# EAGLE design SSM_RGB (EAGLE 8.4.3)
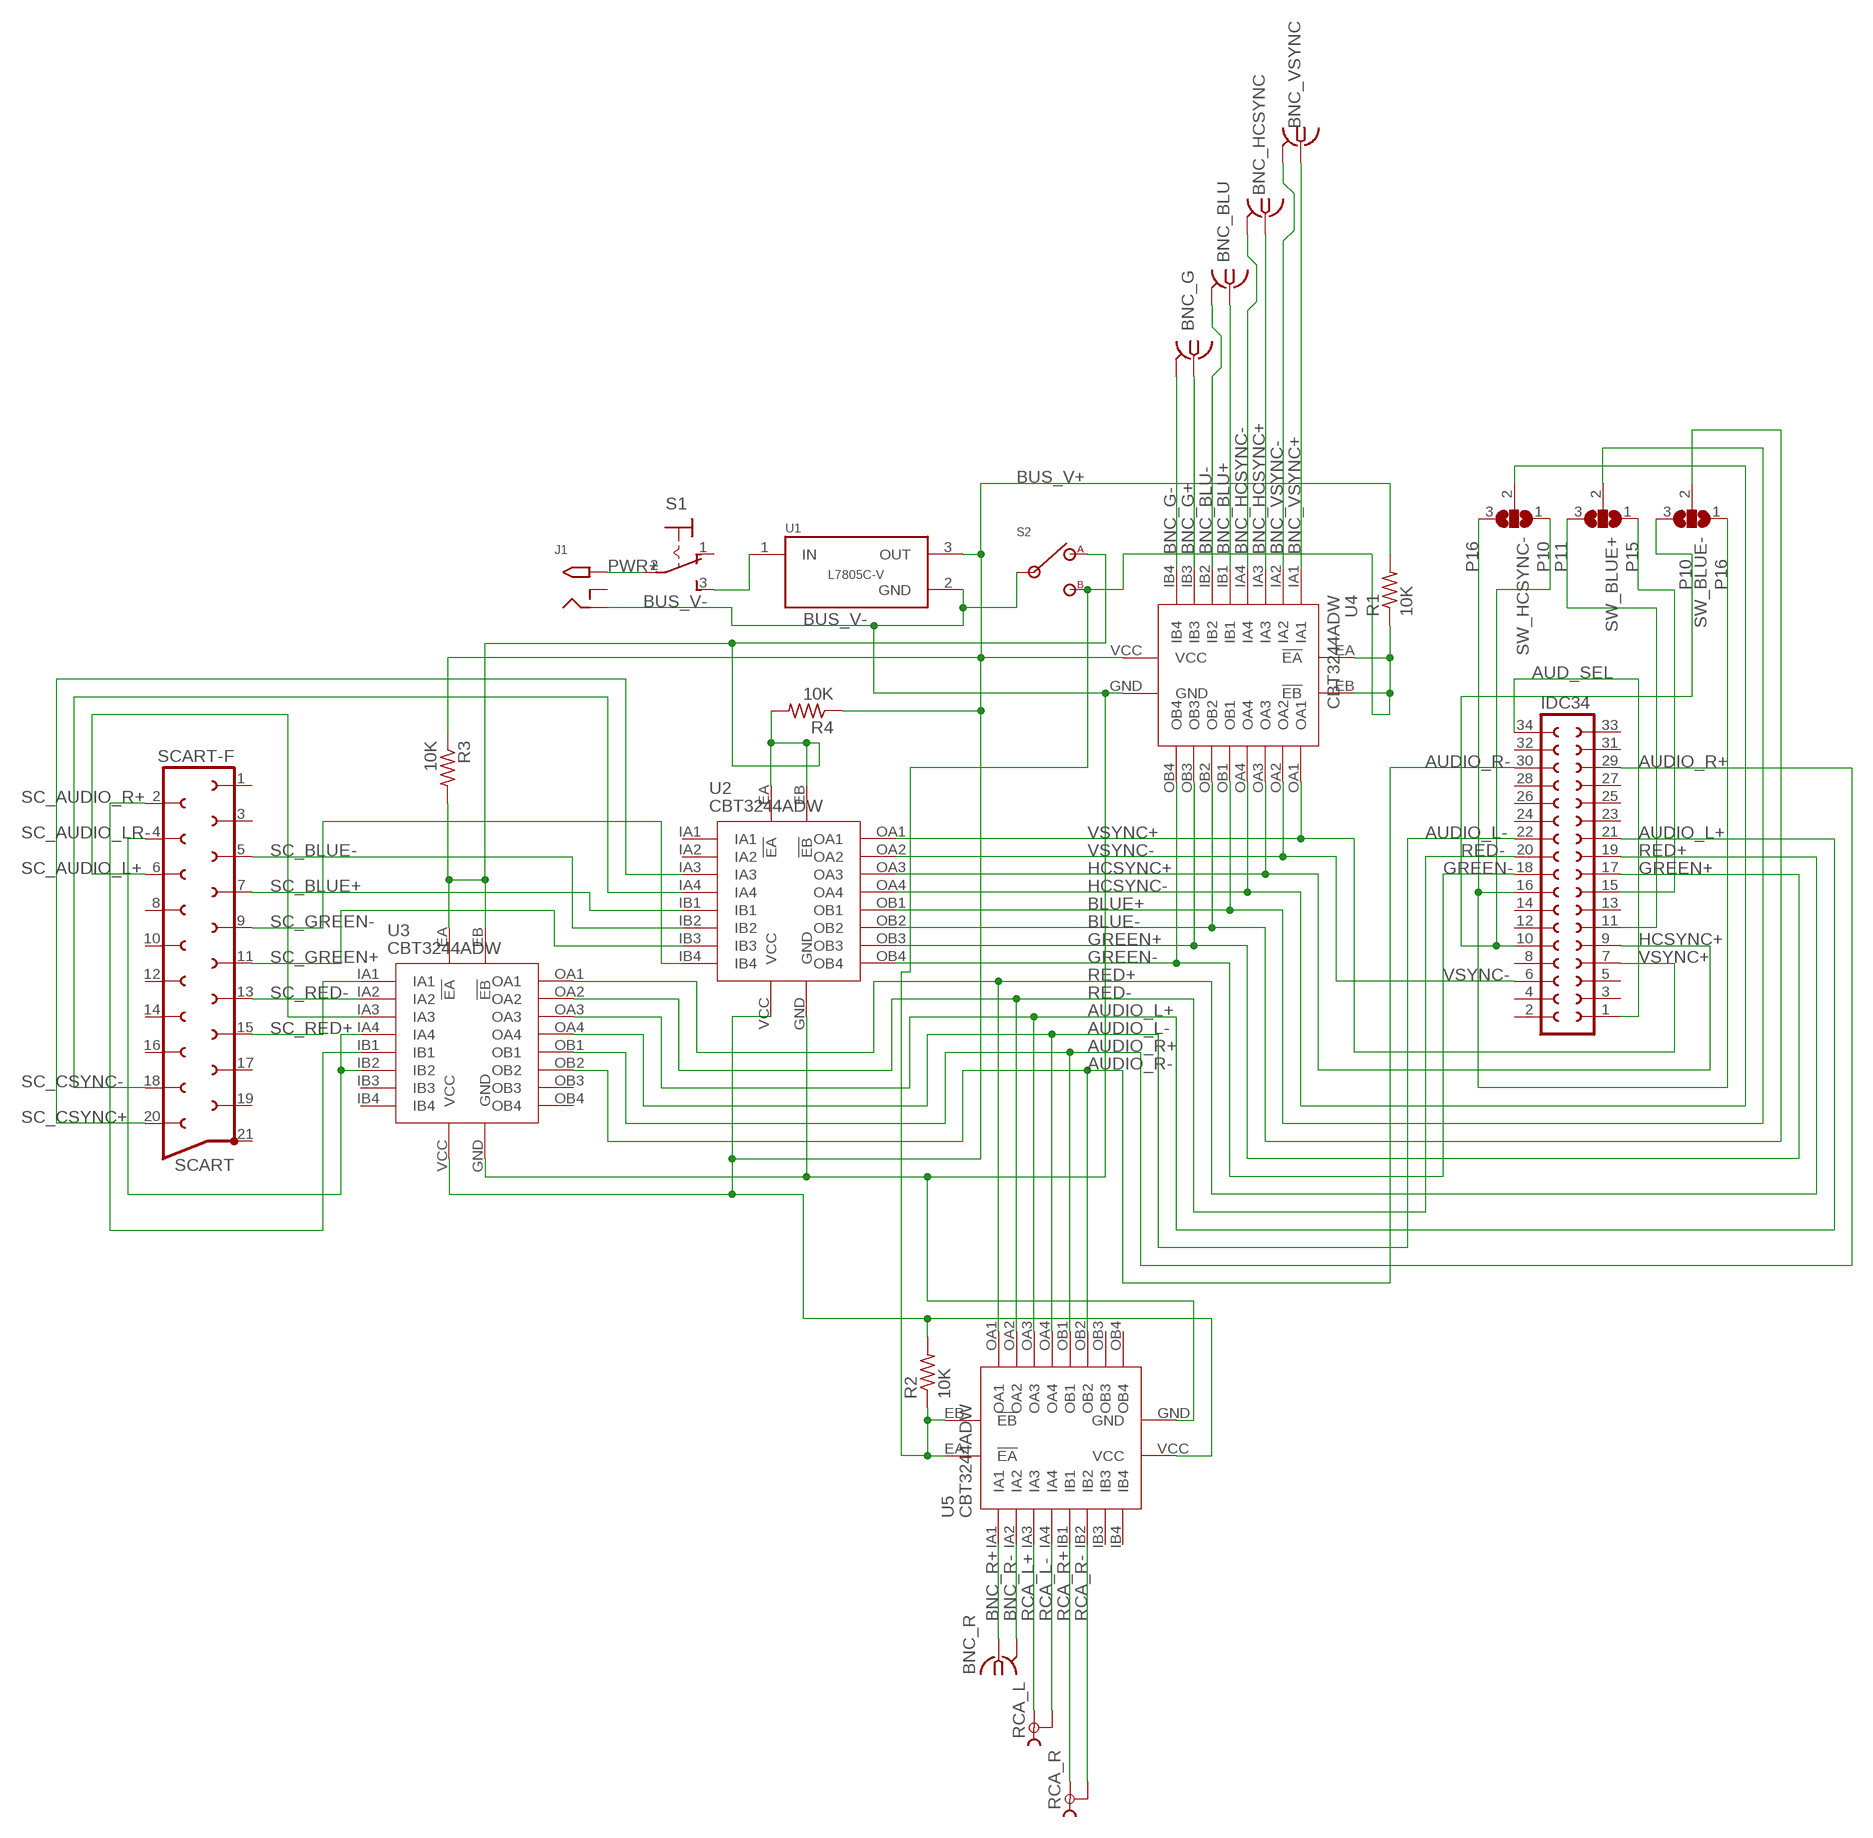
[diagram p0: schematic, sheet 1]

## Parts
BNC_BLU  142142  [142142]
BNC_G  142142  [142142]
BNC_HCSYNC  142142  [142142]
BNC_R  142142  [142142]
BNC_VSYNC  142142  [142142]
IDC34  SOCKET-34RA  [S34RA]
J1  2.1MMJACKTHM  [PJ-102A]
R1  10K  R-US_0207/10  [0207/10]
R2  10K  R-US_0207/10  [0207/10]
R3  10K  R-US_0207/10  [0207/10]
R4  10K  R-US_0207/10  [0207/10]
RCA_L  TOBU3  [TOBU3]
RCA_R  TOBU3  [TOBU3]
S1  320-916  [320-916]
S2  STS121PC04  [STS121PC04]
SCART  SCART-F  [SCART-F]
SW_BLUE+  SJ2W  [SJ_2]
SW_BLUE-  SJ2W  [SJ_2]
SW_HCSYNC-  SJ2W  [SJ_2]
U1  L7805C-V  [TO254P460X1020X1945-3P]
U2  CBT3244ADW  [SOIC-20]
U3  CBT3244ADW  [SOIC-20]
U4  CBT3244ADW  [SOIC-20]
U5  CBT3244ADW  [SOIC-20]

## Nets
AUD_SEL: IDC34.1 IDC34.34
AUDIO_L+: IDC34.21 U3.OA3 U5.OA3
AUDIO_L-: IDC34.22 U3.OA4 U5.OA4
AUDIO_R+: IDC34.29 U3.OB1 U5.OB1
AUDIO_R-: IDC34.30 U3.OB2 U5.OB2
BLUE+: SW_BLUE+.2 U2.OB1 U4.OB1
BLUE-: SW_BLUE-.2 U2.OB2 U4.OB2
BNC_BLU+: BNC_BLU.1 U4.IB1
BNC_BLU-: BNC_BLU.2 BNC_BLU.3 BNC_BLU.4 BNC_BLU.5 U4.IB2
BNC_G+: BNC_G.1 U4.IB3
BNC_G-: BNC_G.2 BNC_G.3 BNC_G.4 BNC_G.5 U4.IB4
BNC_HCSYNC+: BNC_HCSYNC.1 U4.IA3
BNC_HCSYNC-: BNC_HCSYNC.2 BNC_HCSYNC.3 BNC_HCSYNC.4 BNC_HCSYNC.5 U4.IA4
BNC_R+: BNC_R.1 U5.IA1
BNC_R-: BNC_R.2 BNC_R.3 BNC_R.4 BNC_R.5 U5.IA2
BNC_VSYNC+: BNC_VSYNC.1 U4.IA1
BNC_VSYNC-: BNC_VSYNC.2 BNC_VSYNC.3 BNC_VSYNC.4 BNC_VSYNC.5 U4.IA2
BUS_V+: R1.2 R2.2 R3.1 R4.1 U1.3(OUT) U2.VCC U3.VCC U4.VCC U5.VCC
BUS_V-: J1.RING S2.2 U1.2(GND) U2.GND U3.GND U4.GND U5.GND
GREEN+: IDC34.17 U2.OB3 U4.OB3
GREEN-: IDC34.18 U2.OB4 U4.OB4
HCSYNC+: IDC34.9 U2.OA3 U4.OA3
HCSYNC-: SW_HCSYNC-.2 U2.OA4 U4.OA4
N$1: R1.1 R2.1 S2.3 U4.EA(!EA) U4.EB(!EB) U5.EA(!EA) U5.EB(!EB)
N$2: S1.3(S) U1.1(IN)
N$4: R3.2 R4.2 S2.1 U2.EA(!EA) U2.EB(!EB) U3.EA(!EA) U3.EB(!EB)
P10: IDC34.10 SW_BLUE-.3 SW_HCSYNC-.1
P11: IDC34.11 SW_BLUE+.3
P15: IDC34.15 SW_BLUE+.1
P16: IDC34.16 SW_BLUE-.1 SW_HCSYNC-.3
PWR+: J1.TIP S1.2(P)
RCA_L+: RCA_L.1 U5.IA3
RCA_L-: RCA_L.2 RCA_L.2@1 RCA_L.2@2 U5.IA4
RCA_R+: RCA_R.1 U5.IB1
RCA_R-: RCA_R.2 RCA_R.2@1 RCA_R.2@2 U5.IB2
RED+: IDC34.19 U3.OA1 U5.OA1
RED-: IDC34.20 U3.OA2 U5.OA2
SC_AUDIO_L+: SCART.6 U3.IA3
SC_AUDIO_LR-: SCART.4 U3.IA4 U3.IB2
SC_AUDIO_R+: SCART.2 U3.IB1
SC_BLUE+: SCART.7 U2.IB1
SC_BLUE-: SCART.5 U2.IB2
SC_CSYNC+: SCART.20 U2.IA3
SC_CSYNC-: SCART.18 U2.IA4
SC_GREEN+: SCART.11 U2.IB3
SC_GREEN-: SCART.9 U2.IB4
SC_RED+: SCART.15 U3.IA1
SC_RED-: SCART.13 U3.IA2
VSYNC+: IDC34.7 U2.OA1 U4.OA1
VSYNC-: IDC34.6 U2.OA2 U4.OA2
Unconnected: IDC34.2 IDC34.3 IDC34.4 IDC34.5 IDC34.8 IDC34.12 IDC34.13 IDC34.14 IDC34.23 IDC34.24 IDC34.25 IDC34.26 IDC34.27 IDC34.28 IDC34.31 IDC34.32 IDC34.33 J1.RING_SW S1.1(O) SCART.1 SCART.3 SCART.8 SCART.10 SCART.12 SCART.14 SCART.16 SCART.17 SCART.19 SCART.21 U2.IA1 U2.IA2 U3.IB3 U3.IB4 U3.OB3 U3.OB4 U5.IB3 U5.IB4 U5.OB3 U5.OB4

## Library data of the parts
BNC_BLU BNC_G BNC_R BNC_VSYNC = amphenol-142142_10:142142: Amphenol Connex 142142 SMB R/A P. C. B. Mount Plug Source: http://www.amphenolconnex.com/media/downloads/4323/142142.pdf; MF: Amphenol Connex; MPN: 142142; OC_FARNELL: unknown; OC_NEWARK: unknown
BNC_HCSYNC = amphenol-142142_10:142142: Amphenol Connex 142142 SMB R/A P. C. B. Mount Plug Source: http://www.amphenolconnex.com/media/downloads/4323/142142.pdf; MF: Amphenol Connex; OC_FARNELL: unknown; OC_NEWARK: unknown
IDC34 = con-3m-skt-header:SOCKET-34: 34 pin PCB Socket (3m 85xx/51xx)
J1 = adafruit:2.1MMJACK: 2.1mm x 5.5mm THM DC jack with internal switch. Digikey part #PJ-102A, 4UCON part #05537 2.1mm x 5.5mm SMT DC jack with internal switch. Digikey part #PJ-002A-SMT, 4UCON part #03267 By microbuilder.eu & adafruit.com
R1-R4 = resistor:R-US_: RESISTOR, American symbol
RCA_L RCA_R = con-hirschmann:TOBU3: Female Cinch CONNECTOR ( RCA Jack ); MF: FARNELL; MPN: TOBU 3; OC_FARNELL: 592791; OC_NEWARK: 06WX5914
S1 = switch:320-916: TOGGLE SWITCH distributor RS Components
S2 = switches:STS121PC04: Slide Switch SPDT Through Hole; DIGIKEY: 450-1609-ND
SCART = con-hirschmann:SCART-F: TV SCART CONNECTOR; OC_FARNELL: unknown; OC_NEWARK: unknown
SW_BLUE+ SW_BLUE- SW_HCSYNC- = jumper:SJ2W: SMD solder JUMPER
U1 = L7805C-V:L7805C-V: L7805 Series 1.5 A 5 V Three Terminal Voltage Regulator - TO-220; DESCRIPTION: Standard Regulator Pos 5V 1.5A 3-Pin_3+Tab_ TO-220 Standard Regulator Pos 5V 1.5A 3-Pin_3+Tab_ TO-220; DIGI-KEY_PART_NUMBER: 497-1443-5-ND; DIGI-KEY_PURCHASE_URL: https://www.digikey.com/product-detail/en/stmicroelectronics/L7805CV/497-1443-5-ND/585964?utm_source=snapeda&utm_medium=aggregator&utm_campaign=symbol; MF: STMicroelectronics; MP: L7805CV; PACKAGE: TO-220 STMicroelectronics
U2-U5 = EagleSoftCustom:CBT3244A: 2.7 to 5.5V 12-Bit Parallel DAC with power down

## Board
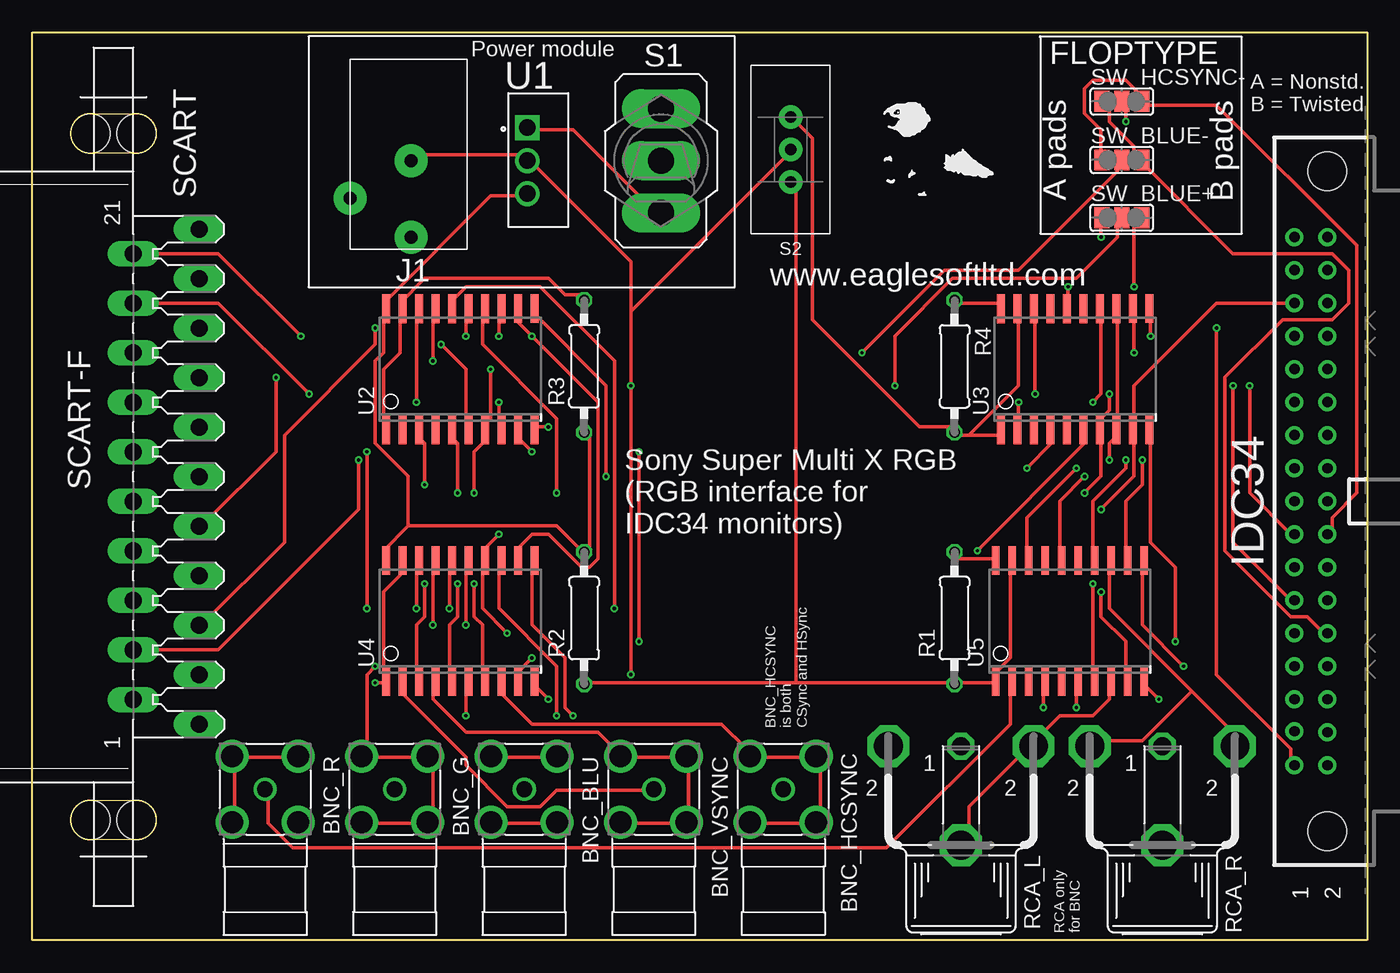
[diagram p1: board, top side]
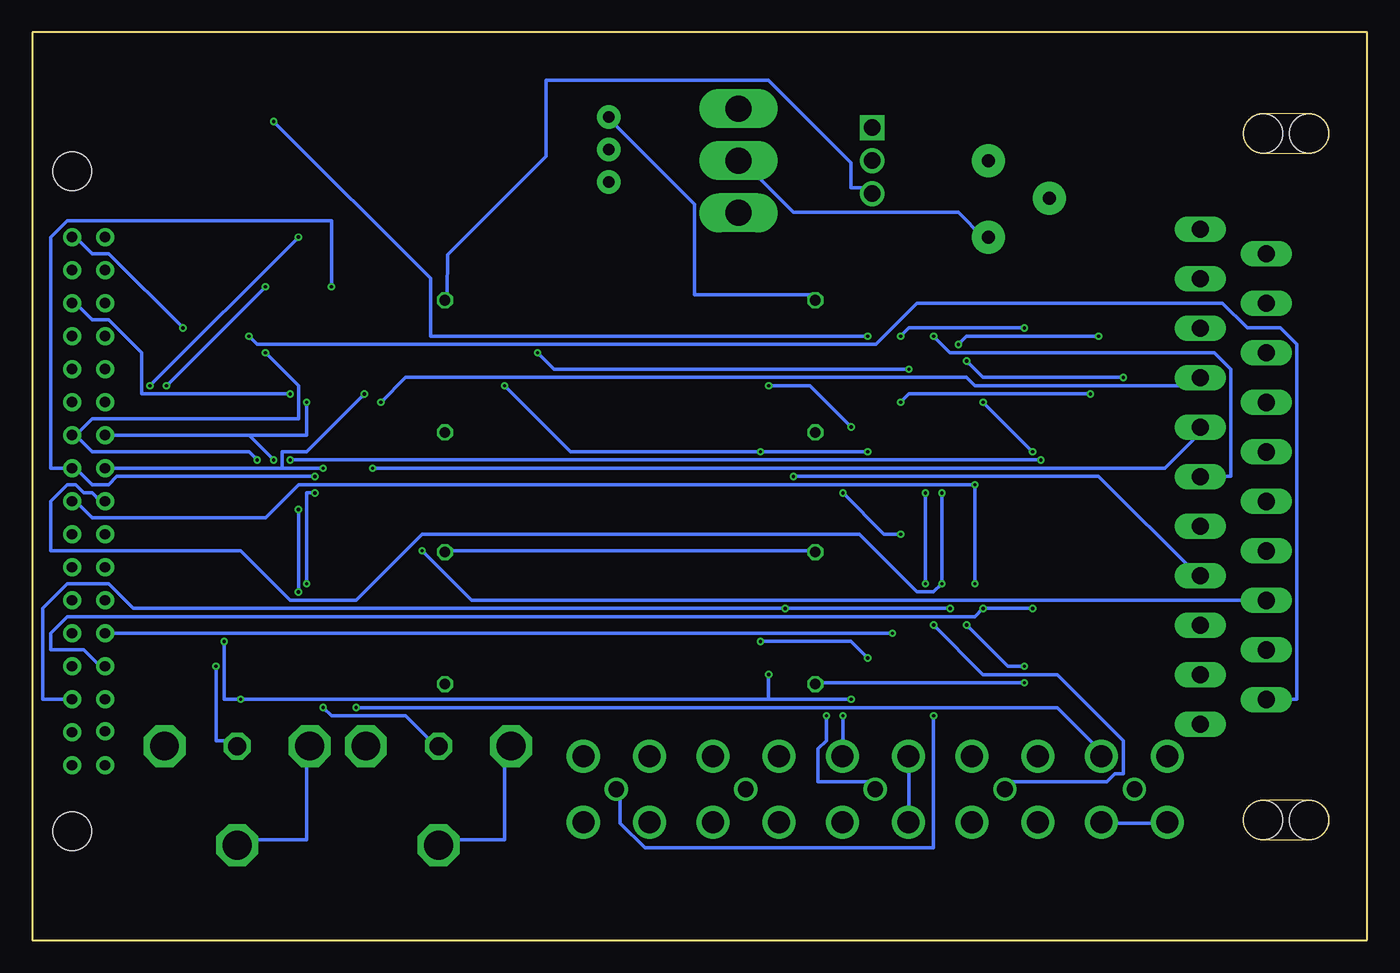
[diagram p2: board, bottom side, seen from below]

Size 102.73 x 69.85 mm. Coordinates in mm from the lower left corner, seen from the top.
Outline: 102.73,69.85 102.73,0 0,0 0,69.85 102.73,69.85
Copper layers (1*16): Top 0.035559375mm / dielectric 1.6mm / Bottom 0.035559375mm
Design rules "oshpark-2layer-auto-routing": minimum track width 10mil, minimum drill 10mil, track to track 10mil, track to pad 8mil, pad to pad 8mil, via to via 8mil, smd to smd 6mil, copper to edge 15mil, drill to drill 6mil, minimum pad ring 6mil, minimum via ring 6mil, stop-mask expansion 2.5mil, vias tented up to drill 0mil, thermal gap 10mil

### Footprints (pad centres in the part's own frame; a part is rotated, then mirrored left to right if it is on the bottom)
142142 = drill 1.2: 1 0,0 | drill 1.7: 2 -2.54,2.54; 3 2.54,2.54; 4 2.54,-2.54; 5 -2.54,-2.54
S34RA = drill 0.8 pad 1.4: 1 20.32,-5.44; 2 20.32,-2.9; 3 17.7,-5.44; 4 17.78,-2.9; 5 15.24,-5.44; 6 15.24,-2.9; 7 12.7,-5.44; 8 12.7,-2.9; 9 10.16,-5.44; 10 10.16,-2.9; 11 7.62,-5.44; 12 7.62,-2.9; 13 5.08,-5.44; 14 5.08,-2.9; 15 2.54,-5.44; 16 2.54,-2.9; 17 0,-5.44; 18 0,-2.9; 19 -2.54,-5.44; 20 -2.54,-2.9; 21 -5.08,-5.44; 22 -5.08,-2.9; 23 -7.62,-5.44; 24 -7.62,-2.9; 25 -10.16,-5.44; 26 -10.16,-2.9; 27 -12.7,-5.44; 28 -12.7,-2.9; 29 -15.24,-5.44; 30 -15.24,-2.9; 31 -17.78,-5.44; 32 -17.78,-2.9; 33 -20.32,-5.44; 34 -20.32,-2.9 | hole 3: -25.39,-2.9; 25.39,-2.9
PJ-102A = drill 1 pad 2.54: RING 0.1,-3.39; RING_SW -4.6,-6.29; TIP 0.1,-9.29
0207/10 = drill 0.813 octagon: 1 -5.08,0; 2 5.08,0
TOBU3 = drill 1.397 octagon: 1 0,-2.54 | drill 2.21 octagon: 2 5.588,-2.54; 2@1 -5.588,-2.54; 2@2 0,5.08
320-916 = drill 2.007 long: 1 0,4.013; 2 0,0; 3 0,-4.013
STS121PC04 = drill 0.9 pad 1.8: 1 -2.5,0; 2 0,0; 3 2.5,0
SCART-F = drill 1.321 long: 1 19.05,5.08; 2 17.145,0; 3 15.24,5.08; 4 13.335,0; 5 11.43,5.08; 6 9.525,0; 7 7.62,5.08; 8 5.715,0; 9 3.81,5.08; 10 1.905,0; 11 0,5.08; 12 -1.905,0; 13 -3.81,5.08; 14 -5.715,0; 15 -7.62,5.08; 16 -9.525,0; 17 -11.43,5.08; 18 -13.335,0; 19 -15.24,5.08; 20 -17.145,0; 21 -19.05,5.08 | hole 3.023: 26.416,0.254; 26.416,-3.302; -26.416,0.254; -26.416,-3.302
SJ_2 = smd 1.168 x 1.6: 1 -1.524,0; 2 0,0; 3 1.524,0
TO254P460X1020X1945-3P = drill 1.27 pad 1.91 square: 1 0,2.54 | drill 1.27 pad 1.91: 2 0,0; 3 0,-2.54
SOIC-20 = smd 0.6 x 2.2: EA -5.842,-4.886; EB -4.572,4.429; GND 5.588,-4.889; IA1 -4.572,-4.886; IA2 -2.032,-4.886; IA3 0.508,-4.886; IA4 3.048,-4.886; IB1 5.588,4.432; IB2 3.048,4.429; IB3 0.508,4.429; IB4 -2.032,4.429; OA1 -3.302,4.429; OA2 -0.762,4.429; OA3 1.778,4.429; OA4 4.318,4.432; OB1 4.318,-4.889; OB2 1.778,-4.886; OB3 -0.762,-4.886; OB4 -3.302,-4.886; VCC -5.842,4.429

### Placement (x,y rotation side)
BNC_BLU  37.85,11.62 270 top
BNC_G  27.88,11.62 270 top
BNC_HCSYNC  57.78,11.62 270 top
BNC_R  17.91,11.62 270 top
BNC_VSYNC  47.82,11.62 270 top
IDC34  102.58,33.78 270 top
J1  29.05,63.38 0 top
R1  70.98,24.78 90 top
R2  42.46,24.78 90 top
R3  42.46,44.16 90 top
R4  70.98,44.16 270 top
RCA_L  71.48,12.4 180 top
RCA_R  86.98,12.4 180 top
S1  48.38,59.98 0 top
S2  58.36,60.85 270 top
SCART  7.76,35.67 270 top
SW_BLUE+  83.85,55.59 0 top
SW_BLUE-  83.85,60.05 0 top
SW_HCSYNC-  83.85,64.55 0 top
U1  38.09,59.98 0 top
U2  33.06,44.16 0 top
U3  80.38,44.16 0 top
U4  33.06,24.78 0 top
U5  79.98,24.78 0 top

### Tracks (layer width: path | path; a pad name or v marks a point on that pad's centre or on a via)
AUD_SEL  (via drill 0.25)
  Top 0.254: v91.15,47.12 91.15,20.45 96.86,14.73 96.86,13.46 IDC34.1
  Bottom 0.254: v91.15,47.12 96.86,52.83 98.13,52.83 99.4,54.1 IDC34.34
AUDIO_L+  (via drill 0.25)
  Top 0.254: v84.16,36.96 84.16,36.32 81.62,33.78 81.62,29.34 U5.OA3 | v81.62,41.4 82.26,42.04 82.26,48.39 U3.OA3
  Bottom 0.254: 86.07,38.86 v84.16,36.96 | IDC34.21 86.07,38.86 | v81.62,41.4 81.62,38.86 86.07,38.86
AUDIO_L-  (via drill 0.25)
  Top 0.254: v85.43,36.96 85.43,35.05 84.16,33.78 84.16,29.34 U5.OA4 | v84.8,45.21 84.8,48.39 U3.OA4
  Bottom 0.254: v85.43,36.96 86.07,37.59 98.13,37.59 99.4,38.86 | v84.8,45.21 82.26,42.67 82.26,40.13 98.13,40.13 99.4,38.86 | 99.4,38.86 IDC34.22
AUDIO_R+  (via drill 0.25)
  Top 0.254: v82.26,26.8 82.26,24.89 84.16,22.99 84.16,20.45 U5.OB1 | v82.26,33.15 84.8,35.69 84.8,38.86 U3.OB1 84.8,39.5 84.8,42.67 91.15,49.02 IDC34.29
  Bottom 0.254: v82.26,33.15 v82.26,26.8
AUDIO_R-  (via drill 0.25)
  Top 0.254: v81.62,27.43 81.62,20.45 U5.OB2 | v80.99,34.42 82.26,35.69 82.26,38.86 U3.OB2 82.26,39.5 82.26,40.13 82.89,40.77 v82.89,42.04
  Bottom 0.254: v81.62,27.43 81.62,34.42 v80.99,34.42 | v82.89,42.04 94.32,42.04 94.32,45.21 96.86,47.75 98.13,47.75 99.4,49.02 IDC34.30
BLUE+  (via drill 0.25)
  Top 0.254: v66.38,42.67 66.38,46.48 70.83,50.93 80.35,50.93 83.53,54.1 83.53,55.37 SW_BLUE+.2 | v38.44,37.59 37.17,38.86 U2.OB1 | v38.44,21.72 37.17,20.45 U4.OB1 | v46.7,37.59 v46.7,22.99
  Bottom 0.254: v66.38,42.67 61.3,37.59 v46.7,37.59 v38.44,37.59 | v38.44,21.72 39.71,22.99 v46.7,22.99
BLUE-  (via drill 0.25)
  Top 0.254: v63.84,45.21 70.19,51.56 75.91,51.56 83.53,59.18 83.53,59.82 SW_BLUE-.2 | v35.27,43.94 35.27,40.13 34.63,39.5 U2.OB2 34.63,38.86 34.63,38.23 34,37.59 v34,34.42 | v34,27.43 34,24.89 34.63,24.26 34.63,20.45 U4.OB2
  Bottom 0.254: v63.84,45.21 62.57,43.94 v35.27,43.94 | v34,34.42 v34,27.43
BNC_BLU+  (via drill 0.25)
  Top 0.254: v41.62,17.27 40.98,17.91 40.98,21.72 38.44,24.26 38.44,28.7 U4.IB1
  Bottom 0.254: v41.62,17.27 41.62,15.37 42.25,14.73 42.25,12.19 38.44,12.19 BNC_BLU.1
BNC_BLU-  (via drill 0.25)
  Top 0.254: BNC_BLU.4 35.9,9.02 40.35,9.02 BNC_BLU.3 | v40.35,17.27 40.35,21.08 35.9,25.53 35.9,28.7 U4.IB2 | BNC_BLU.5 35.9,14.1 40.35,14.1 BNC_BLU.2
  Bottom 0.254: v40.35,17.27 40.35,14.73 BNC_BLU.2 | BNC_BLU.4 35.27,9.65 35.27,14.1 BNC_BLU.5
BNC_G+  (via drill 0.25)
  Top 0.254: v33.36,24.26 33.36,28.7 U4.IB3
  Bottom 0.254: v33.36,24.26 29.55,20.45 23.84,20.45 18.76,15.37 18.76,12.83 19.39,12.83 20.03,12.19 27.65,12.19 BNC_G.1
BNC_G-  (via drill 0.25)
  Top 0.254: BNC_G.4 25.74,9.02 30.19,9.02 BNC_G.3 30.82,9.65 30.82,14.1 BNC_G.2 30.19,14.1 25.74,14.1 BNC_G.5 25.74,14.73 25.74,20.45 v26.38,21.08 | v30.82,24.26 30.82,28.7 U4.IB4
  Bottom 0.254: v30.82,24.26 27.65,21.08 v26.38,21.08
BNC_HCSYNC+  (via drill 0.25)
  Top 0.254: v33.36,17.27 33.36,19.81 U4.IA3
  Bottom 0.254: v33.36,17.27 33.36,7.11 55.59,7.11 57.49,9.02 57.49,11.56 BNC_HCSYNC.1
BNC_HCSYNC-
  Top 0.254: BNC_HCSYNC.4 55.59,9.02 60.03,9.02 BNC_HCSYNC.3 60.67,9.65 60.67,14.1 BNC_HCSYNC.2 60.03,14.1 55.59,14.1 BNC_HCSYNC.5 54.95,14.73 53.05,16.64 38.44,16.64 35.9,19.18 35.9,19.81 U4.IA4
BNC_R+
  Top 0.254: U5.IA1 75.27,19.81 75.27,16.64 65.75,7.11 20.03,7.11 18.12,9.02 18.12,11.56 BNC_R.1
BNC_R-  (via drill 0.25)
  Top 0.254: v77.81,17.91 77.81,19.81 U5.IA2 | 15.58,14.1 20.03,14.1 BNC_R.2 | 15.58,14.1 15.58,9.65 BNC_R.4 | 15.58,14.1 BNC_R.5
  Bottom 0.254: BNC_R.4 15.58,9.02 20.03,9.02 BNC_R.3 | v77.81,17.91 23.84,17.91 20.66,14.73 BNC_R.2
BNC_VSYNC+
  Top 0.254: U4.IA1 28.28,19.81 28.28,19.18 33.36,14.1 33.36,13.46 36.54,10.29 39.08,10.29 40.35,11.56 47.33,11.56 BNC_VSYNC.1
BNC_VSYNC-
  Top 0.254: BNC_VSYNC.4 45.43,9.02 49.87,9.02 BNC_VSYNC.3 50.51,9.65 50.51,14.1 BNC_VSYNC.2 49.87,14.1 45.43,14.1 BNC_VSYNC.5 44.79,14.73 43.52,16 33.36,16 30.82,18.54 30.82,19.81 U4.IA2
BUS_V+
  Top 0.254: U5.VCC 74,29.34 70.83,29.34 R1.2 | 28.92,31.88 27.01,29.97 27.01,29.34 U4.VCC | 28.92,31.88 40.35,31.88 42.25,29.97 R2.2 42.89,29.97 42.89,38.86 R3.1 | U3.VCC 74.64,49.02 71.46,49.02 R4.1 | U1.3 37.81,57.28 35.27,57.28 27.01,49.02 U2.VCC 27.01,48.39 27.01,45.21 26.38,44.58 26.38,38.23 28.92,35.69 28.92,31.88
  Bottom 0.254: R1.2 70.83,29.97 42.89,29.97 R2.2 | R4.1 70.83,49.66 70.79,52.75 63.21,60.33 63.21,66.17 46.06,66.17 39.71,59.82 39.71,57.91 38.44,57.91 U1.3
BUS_V-  (via drill 0.25)
  Top 0.254: v39.71,39.5 38.44,39.5 U2.GND | 46.06,48.39 46.06,52.2 38.44,59.82 U1.2 37.81,60.45 29.55,60.45 J1.RING | 46.06,48.39 v46.06,42.67 v46.06,20.45 | 46.06,48.39 58.13,60.45 S2.2 | v39.71,18.54 38.44,19.81 U4.GND | v86.7,18.54 85.43,19.81 U5.GND | v87.97,22.99 87.97,28.7 86.07,30.61 86.07,38.86 U3.GND
  Bottom 0.254: v39.71,39.5 42.89,42.67 v46.06,42.67 | 46.06,18.54 v86.7,18.54 87.97,18.54 v87.97,22.99 | 46.06,18.54 v39.71,18.54 | 46.06,18.54 v46.06,20.45
GREEN+  (via drill 0.25)
  Top 0.254: v32.73,27.43 32.73,24.89 32.09,24.26 32.09,20.45 U4.OB3 | v32.73,34.42 32.73,38.23 32.09,38.86 U2.OB3
  Bottom 0.254: v32.73,34.42 v32.73,27.43 33.36,26.8 34.63,26.8 39.08,31.24 72.73,31.24 77.81,26.16 82.89,26.16 86.7,29.97 101.31,29.97 101.31,33.78 100.04,35.05 99.4,35.05 98.77,34.42 98.13,34.42 97.5,33.78 IDC34.17
GREEN-  (via drill 0.25)
  Top 0.254: v30.19,27.43 30.19,24.89 29.55,24.26 29.55,20.45 U4.OB4 | v30.19,35.05 30.19,38.23 29.55,38.86 U2.OB4
  Bottom 0.254: v30.19,27.43 v30.19,35.05 82.26,35.05 84.8,32.51 98.13,32.51 99.4,33.78 IDC34.18
HCSYNC+  (via drill 0.25)
  Top 0.254: v36.54,23.62 34.63,25.53 34.63,28.7 U4.OA3 34.63,29.34 34.63,29.97 v35.9,31.24 | v40.35,34.42 40.35,40.13 34.63,45.85 34.63,48.39 U2.OA3
  Bottom 0.254: IDC34.9 v36.54,23.62 | v40.35,34.42 37.17,31.24 v35.9,31.24
HCSYNC-  (via drill 0.25)
  Top 0.254: v84.16,62.99 84.16,64.26 SW_HCSYNC-.2 | U2.OA4 37.17,48.39 37.17,47.75 v38.44,46.48 43.52,41.4 43.52,29.34 42.89,28.7 42.25,28.7 39.71,31.24 38.44,31.24 37.17,29.97 37.17,29.34 U4.OA4
  Bottom 0.254: v84.16,62.99 72.1,50.93 72.1,46.48 v38.44,46.48
N$1  (via drill 0.25)
  Top 0.254: U4.EB 28.28,28.7 28.28,28.07 27.01,26.8 27.01,20.45 U4.EA 27.01,19.81 v26.38,19.81 | U5.EB 75.27,28.7 75.27,21.72 74,20.45 U5.EA 74,19.81 71.46,19.81 R1.1 70.83,19.81 58.76,19.81 | 58.76,19.81 42.89,19.81 R2.1 | 58.76,19.81 58.76,57.91 S2.3
  Bottom 0.254: v26.38,19.81 42.25,19.81 R2.1
N$2
  Top 0.254: U1.1 38.44,62.36 41.62,62.36 47.97,56.01 S1.3
N$4
  Top 0.254: 72.1,38.86 71.46,38.86 R4.2 70.83,39.5 68.29,39.5 60.03,47.75 60.03,61.72 58.76,62.99 S2.1 | 72.1,38.86 74.64,38.86 U3.EA | 72.1,38.86 75.91,42.67 75.91,48.39 U3.EB | U2.EA 27.01,39.5 27.01,43.94 28.28,45.21 28.28,48.39 U2.EB 28.28,49.02 30.19,50.93 39.71,50.93 40.98,49.66 42.25,49.66 R3.2
  Bottom 0.254: S2.1 58.13,62.99 51.78,56.64 51.78,49.66 42.89,49.66 R3.2
P10
  Top 0.254: SW_HCSYNC-.1 82.89,64.26 82.89,62.99 84.8,61.09 84.8,60.45 SW_BLUE-.3 85.43,59.82 92.42,52.83 100.04,52.83 101.31,51.56 101.31,49.02 100.04,47.75 96.23,47.75 91.78,43.31 91.78,29.97 96.86,24.89 98.13,24.89 99.4,23.62 IDC34.10
P11  (via drill 0.25)
  Top 0.254: v84.8,50.29 84.8,55.37 SW_BLUE+.3 | v92.42,42.67 92.42,30.61 96.86,26.16 IDC34.11
  Bottom 0.254: v92.42,42.67 v84.8,50.29
P15  (via drill 0.25)
  Top 0.254: v82.26,54.1 82.26,55.37 SW_BLUE+.1 | v93.69,42.67 93.69,34.42 96.86,31.24 IDC34.15
  Bottom 0.254: v93.69,42.67 v82.26,54.1
P16
  Top 0.254: SW_BLUE-.1 82.26,60.45 82.26,62.36 80.99,63.63 80.99,65.53 81.62,66.17 84.16,66.17 85.43,64.9 SW_HCSYNC-.3 85.43,64.26 91.15,64.26 101.94,53.47 101.94,34.42 100.04,32.51 100.04,31.24 IDC34.16
PWR+
  Bottom 0.254: J1.TIP 29.55,54.1 31.46,56.01 44.16,56.01 47.97,59.82 S1.2
RCA_L+  (via drill 0.25)
  Top 0.254: v80.35,17.91 80.35,19.81 U5.IA3
  Bottom 0.254: v80.35,17.91 79.72,17.27 74,17.27 72.1,15.37 RCA_L.1
RCA_L-
  Top 0.254: U5.IA4 82.89,19.81 82.89,18.54 81.62,17.27 79.08,17.27 77.18,15.37 RCA_L.2@1 76.54,14.73 72.1,10.29 72.1,7.75 RCA_L.2@2
  Bottom 0.254: RCA_L.2 66.38,14.73 66.38,7.75 71.46,7.75 RCA_L.2@2
RCA_R+  (via drill 0.25)
  Top 0.254: v88.61,21.08 85.43,24.26 85.43,28.7 U5.IB1
  Bottom 0.254: v88.61,21.08 88.61,15.37 87.34,15.37 RCA_R.1
RCA_R-
  Top 0.254: 89.24,19.18 93.05,15.37 RCA_R.2@1 | 89.24,19.18 82.89,25.53 82.89,28.7 U5.IB2 | 89.24,19.18 85.43,15.37 81.62,15.37 RCA_R.2
  Bottom 0.254: RCA_R.2 81.62,14.73 81.62,7.75 86.7,7.75 RCA_R.2@2
RED+  (via drill 0.25)
  Top 0.254: v80.35,36.32 76.54,32.51 76.54,29.34 U5.OA1 | v77.18,42.04 77.18,48.39 U3.OA1
  Bottom 0.254: IDC34.19 83.53,36.32 | 83.53,36.32 v80.35,36.32 | v77.18,42.04 81.62,37.59 83.53,37.59 83.53,36.32
RED-  (via drill 0.25)
  Top 0.254: v80.99,35.69 79.08,33.78 79.08,29.34 U5.OA2 | v79.72,50.29 79.72,49.02 U3.OA2
  Bottom 0.254: v80.99,35.69 96.23,35.69 96.86,35.05 98.13,35.05 99.4,36.32 IDC34.20 101.31,36.32 101.31,54.1 100.04,55.37 79.72,55.37 v79.72,50.29
SC_AUDIO_L+  (via drill 0.25)
  Top 0.254: v72.73,29.97 80.99,38.23 80.99,38.86 U3.IA3
  Bottom 0.254: v72.73,29.97 68.92,26.16 7.96,26.16 SCART.6
SC_AUDIO_LR-  (via drill 0.25)
  Top 0.254: U3.IB2 83.53,48.39 83.53,39.5 U3.IA4 83.53,38.86 82.89,38.23 v82.89,36.96 | v25.11,36.96 25.11,33.15 14.31,22.35 7.96,22.35 SCART.4
  Bottom 0.254: v82.89,36.96 v25.11,36.96
SC_AUDIO_R+  (via drill 0.25)
  Top 0.254: v86.07,46.48 86.07,48.39 U3.IB1
  Bottom 0.254: v86.07,46.48 85.43,45.85 37.81,45.85 34.63,49.02 11.14,49.02 9.23,47.12 6.69,47.12 5.42,45.85 5.42,18.54 7.33,18.54 SCART.2
SC_BLUE+  (via drill 0.25)
  Top 0.254: v44.16,35.69 44.16,42.67 38.44,48.39 U2.IB1
  Bottom 0.254: v44.16,35.69 20.66,35.69 13.04,28.07 SCART.7
SC_BLUE-  (via drill 0.25)
  Top 0.254: v35.9,46.48 35.9,48.39 U2.IB2 | v26.38,47.12 26.38,45.85 19.39,38.86 19.39,30.61 13.04,24.26 SCART.5
  Bottom 0.254: v35.9,46.48 35.27,47.12 v26.38,47.12
SC_CSYNC+  (via drill 0.25)
  Top 0.254: v31.46,45.85 33.36,43.94 33.36,39.5 U2.IA3 | v20.66,46.48 14.31,52.83 7.96,52.83 SCART.20
  Bottom 0.254: v31.46,45.85 30.82,46.48 v20.66,46.48
SC_CSYNC-  (via drill 0.25)
  Top 0.254: v35.9,41.4 35.9,39.5 U2.IA4 | v21.3,42.04 14.31,49.02 7.96,49.02 SCART.18
  Bottom 0.254: v35.9,41.4 35.27,42.04 v21.3,42.04
SC_GREEN+  (via drill 0.25)
  Top 0.254: v33.36,46.48 33.36,48.39 U2.IB3
  Bottom 0.254: v33.36,46.48 32.09,45.21 11.77,45.21 10.5,43.94 10.5,35.69 12.41,35.69 SCART.11
SC_GREEN-  (via drill 0.25)
  Top 0.254: v30.82,44.58 30.82,48.39 U2.IB4 | v18.76,43.31 18.76,37.59 13.04,31.88 SCART.9
  Bottom 0.254: v30.82,44.58 29.55,43.31 v18.76,43.31
SC_RED+  (via drill 0.25)
  Top 0.254: v75.91,41.4 75.91,39.5 U3.IA1
  Bottom 0.254: v75.91,41.4 74,43.31 30.82,43.31 30.19,42.67 13.04,42.67 SCART.15
SC_RED-  (via drill 0.25)
  Top 0.254: v76.54,36.32 78.45,38.23 78.45,38.86 U3.IA2
  Bottom 0.254: v76.54,36.32 15.58,36.32 13.04,38.86 SCART.13
VSYNC+  (via drill 0.25)
  Top 0.254: v29.55,25.53 29.55,28.7 U4.OA1 | v29.55,41.4 29.55,48.39 U2.OA1 | v25.74,25.53 v25.74,37.59
  Bottom 0.254: IDC34.7 97.5,21.08 98.77,22.35 101.31,22.35 101.31,23.62 100.04,24.89 30.19,24.89 v29.55,25.53 v25.74,25.53 | v25.74,37.59 v29.55,41.4
VSYNC-  (via drill 0.25)
  Top 0.254: v32.09,25.53 32.09,28.7 U4.OA2 | v44.79,25.53 44.79,44.58 39.08,50.29 33.36,50.29 32.09,49.02 U2.OA2
  Bottom 0.254: v32.09,25.53 v44.79,25.53 94.96,25.53 96.86,27.43 100.04,27.43 101.94,25.53 101.94,18.54 IDC34.6

### Text on the board
tPlace: A = Nonstd. / B = Twisted | BNC_HCSYNC / is both / CSync and HSync | RCA only / for BNC
tNames: Power module | FLOPTYPE | A pads | B pads | J1 | www.eaglesoftltd.com | Sony Super Multi X RGB / (RGB interface for / IDC34 monitors)